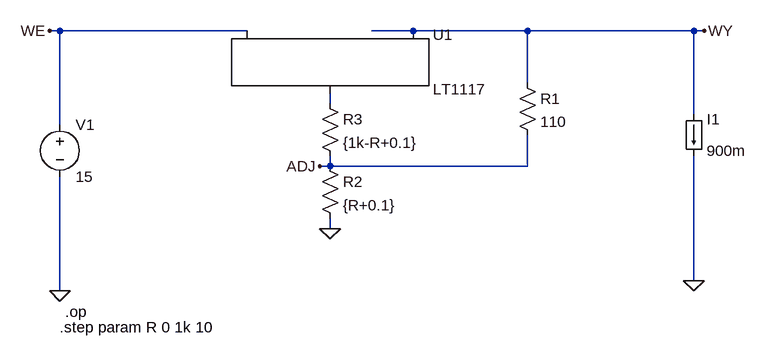
[diagram p0: schematic LT1117lista3.asc]
LT1117lista3.asc, the LTspice schematic file:
Version 4.1
SHEET 1 884 680
WIRE -192 144 -208 144
WIRE 96 144 -192 144
WIRE 352 144 288 144
WIRE 528 144 352 144
WIRE 784 144 528 144
WIRE 800 144 784 144
WIRE 528 224 528 144
WIRE 224 256 224 240
WIRE 784 272 784 144
WIRE -192 288 -192 144
WIRE 224 352 224 336
WIRE 224 352 208 352
WIRE 528 352 528 304
WIRE 528 352 224 352
WIRE 224 448 224 432
WIRE 784 528 784 336
WIRE -192 544 -192 368
FLAG -192 544 0
FLAG 784 528 0
FLAG 800 144 WY
FLAG 208 352 ADJ
FLAG -208 144 WE
FLAG 224 448 0
SYMBOL PowerProducts\\LT1117 224 144 R0
SYMATTR InstName U1
SYMBOL res 512 208 R0
SYMATTR InstName R1
SYMATTR Value 110
SYMBOL voltage -192 272 R0
WINDOW 123 0 0 Left 0
WINDOW 39 0 0 Left 0
SYMATTR InstName V1
SYMATTR Value 15
SYMBOL load 768 272 R0
WINDOW 123 0 0 Left 0
WINDOW 39 0 0 Left 0
SYMATTR InstName I1
SYMATTR Value 900m
SYMBOL res 208 336 R0
SYMATTR InstName R2
SYMATTR Value {R+0.1}
SYMBOL res 208 240 R0
SYMATTR InstName R3
SYMATTR Value {1k-R+0.1}
TEXT -192 600 Left 2 !.step param R 0 1k 10
TEXT -184 576 Left 2 !.op

The netlist it stands for:
* LT1117lista3.asc
X§U1 N001 WY WE LT1117
R1 WY ADJ 110
V1 WE 0 15
I1 WY 0 900m
R2 ADJ 0 {R+0.1}
R3 N001 ADJ {1k-R+0.1}
.step param R 0 1k 10
.op
.lib LT1117.lib
.backanno
.end

* Results of the author's LTspice run, read from the files saved beside the schematic
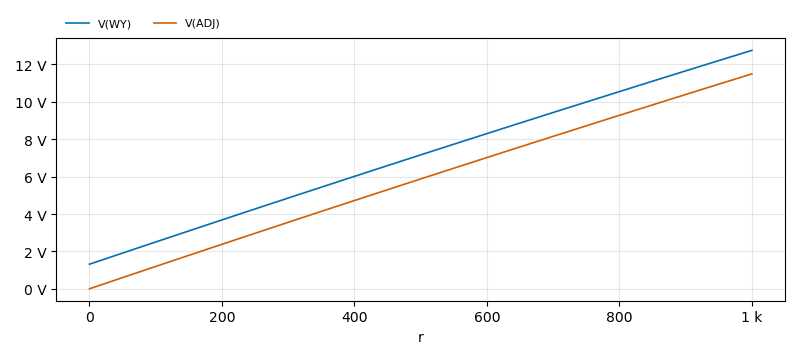
[diagram p1: Operating Point of LT1117lista3.asc, plotted from the saved traces]
* Operating Point, 1 run:
*   V(WY): 1.315 V at r=0, 12.75 V at r=1 k, min 1.315 V, max 12.75 V
*   V(ADJ): 1.2 mV at r=0, 11.49 V at r=1 k, min 1.2 mV, max 11.49 V